# Altium schematic sheet Interconnect.SchDoc
size Letter; SheetNumber: 1; SheetTotal: 1
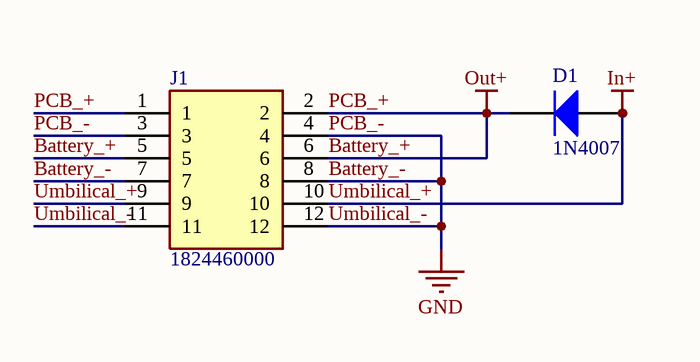
[diagram p0: Interconnect.SchDoc]

## Parts
D1  1N4007  [FAIR-DO-41-2]
J1  1824460000  [SHDR12W80P700X350_2X6_2170X1400X850P]

## Nets
Battery_+: D1.1(K) J1.1 J1.2 J1.5 J1.6  [also labelled Out+, PCB_+]
Battery_-: J1.3 J1.4 J1.7 J1.8 J1.11 J1.12  [also labelled GND, PCB_-, Umbilical_-]
Umbilical_+: D1.2(A) J1.9 J1.10  [also labelled In+]

## Library data of the parts
D1 = CMP-004-00007-2: General Purpose Rectifier, 1.1 V, 1.0 A, -55 to 175 degC, 2-Pin DO-41, RoHS, Tape and Reel; Manufacturer: Fairchild; Peak Reverse Current: 5uA; Max Surge Current: 30A; Elements: 1; Forward Voltage: 1.1V; Package Version: Rev. 2, 09/2008; Forward Current: 1A; Package Quantity: 5000; Packaging: TapeandReel; Package URL: http://www.fairchildsemi.com/dwg/DO/DO41A.pdf; Manufacturer URL: https://www.fairchildsemi.com/; Package Reference: DO-41-2; Pins: 2; Min Operating Temperature: -55°C; Datasheet Version: Rev. 1.1.0, 11/2014; Max Operating Temperature: 175°C; RoHS Compliant: True; Case/Package: DO-41-2; Mounting Technology: TH; Package Description: 2-Pin Axial Lead, Dia 2.375 mm, Body Length 4.63 mm; Datasheet URL: https://www.fairchildsemi.com/datasheets/1N/1N4007.pdf
J1 = CMP-062-000000-2: Printed circuit board terminals, 3.50 mm, Number of poles: 6, 90, Solder pin length: 3.5 mm, black, PUSH IN with actuator, Clamping range, max. [rated connection]: 1.5 mm, Tube; Manufacturer_Name: Weidmuller; Geometry.Height: 8.5mm; Mouser Price/Stock: https://www.mouser.co.uk/ProductDetail/Weidmuller/1824460000?qs=WJDKaGZ8K%252B6qGfZkM4Ritg%3D%3D; Design Item ID: 1824460000; Mouser Part Number: 470-1824460000; Datasheet Link: http://catalog.weidmueller.com/createDatasheetForMobile.do?ordernumber=1824460000&scope1=1&scope2=1&localeId=en; Source: 1824460000.SchLib; Manufacturer_Part_Number: 1824460000